# EAGLE schematic master_carconnector (EAGLE 6.1)
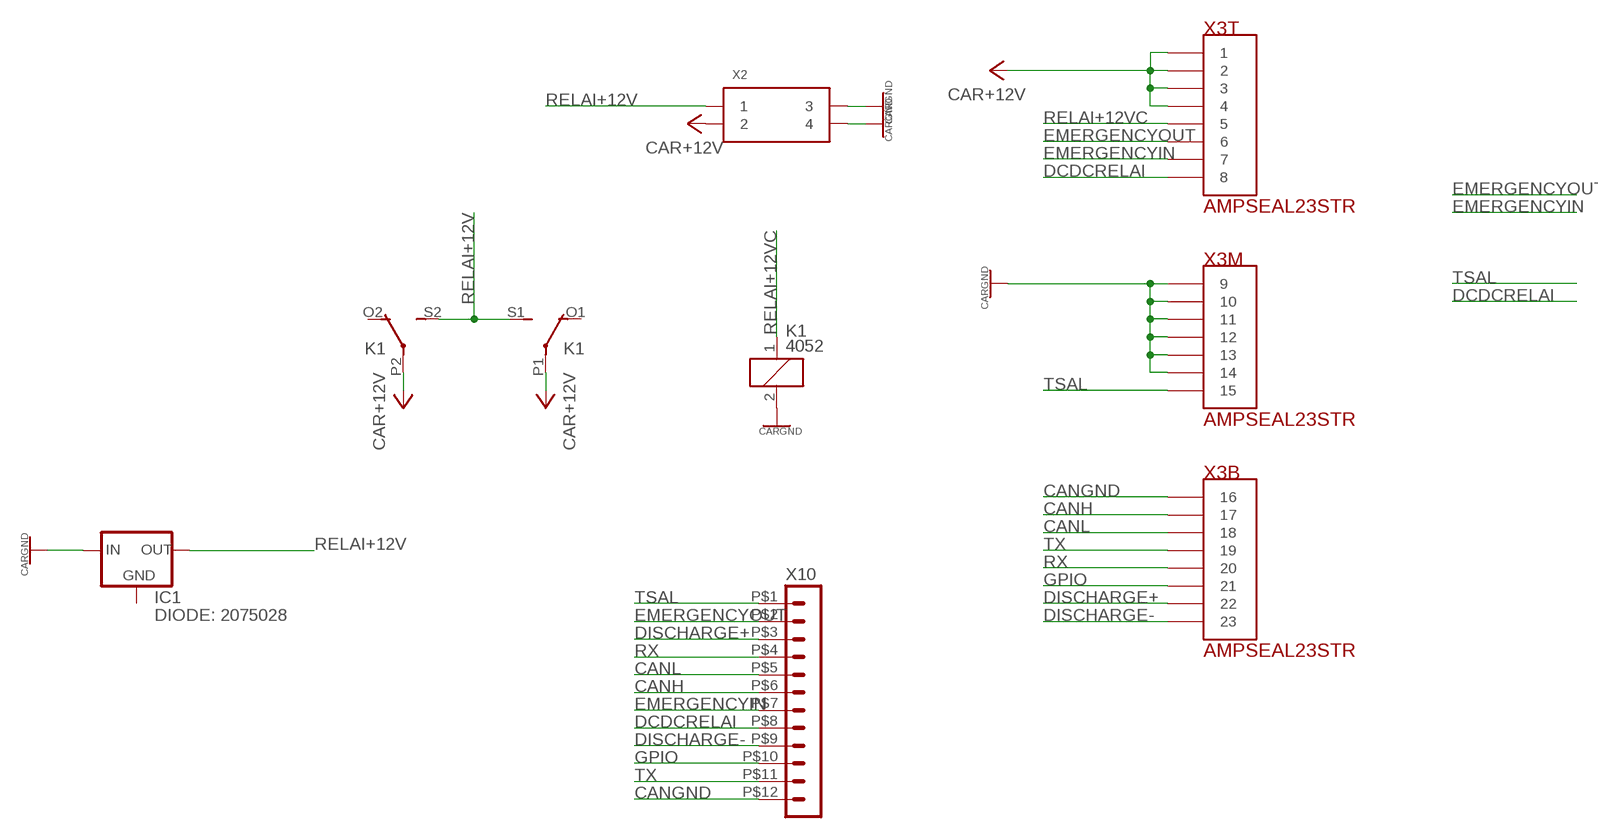
[diagram p0: schematic, sheet 1]

## Parts
IC1  DIODE: 2075028  LM1117TO252  [TO252]
K1  4052  [F4052]
X2  MINI-FIT-JR-045566  [5566-04]
X3  AMPSEAL23STR  [AMPSEAL23-STR]
X10  HEADER_POS12_43045-1212  [43045-1212]

## Nets
CANGND: X3.P$16 X10.P$12
CANH: X3.P$17 X10.P$6
CANL: X3.P$18 X10.P$5
CAR+12V: K1.P1(2:P) K1.P2(3:P) X2.P2 X3.P$1 X3.P$2 X3.P$3 X3.P$4
CARGND: IC1.2(IN) K1.2 X2.P3 X2.P4 X3.P$9 X3.P$10 X3.P$11 X3.P$12 X3.P$13 X3.P$14
DCDCRELAI: X3.P$8 X10.P$8
DISCHARGE+: X3.P$22 X10.P$3
DISCHARGE-: X3.P$23 X10.P$9
EMERGENCYIN: X3.P$7 X10.P$7
EMERGENCYOUT: X3.P$6 X10.P$2
GPIO: X3.P$21 X10.P$10
RELAI+12V: IC1.3(OUT) K1.S1(2:S) K1.S2(3:S) X2.P1
RELAI+12VC: K1.1 X3.P$5
RX: X3.P$20 X10.P$4
TSAL: X3.P$15 X10.P$1
TX: X3.P$19 X10.P$11
Unconnected: IC1.1(GND) K1.O1(2:O) K1.O2(3:O)

## Library data of the parts
IC1 = v-reg-3:LM1117
K1 = relay:4052: RELAY 2 x switch, Finder; OC_FARNELL: unknown; OC_NEWARK: unknown
X2 = con-molex-minifitjr:MINI-FIT-JR-04
X3 = bms-hsrm:AMPSEAL23
X10 = con-molex-micro-fit-3_0:HEADER_POS12_?: Molex - Micro-Fit 3.0 Series connector, 3.00mm (0.118") pitch header, 12 positions.